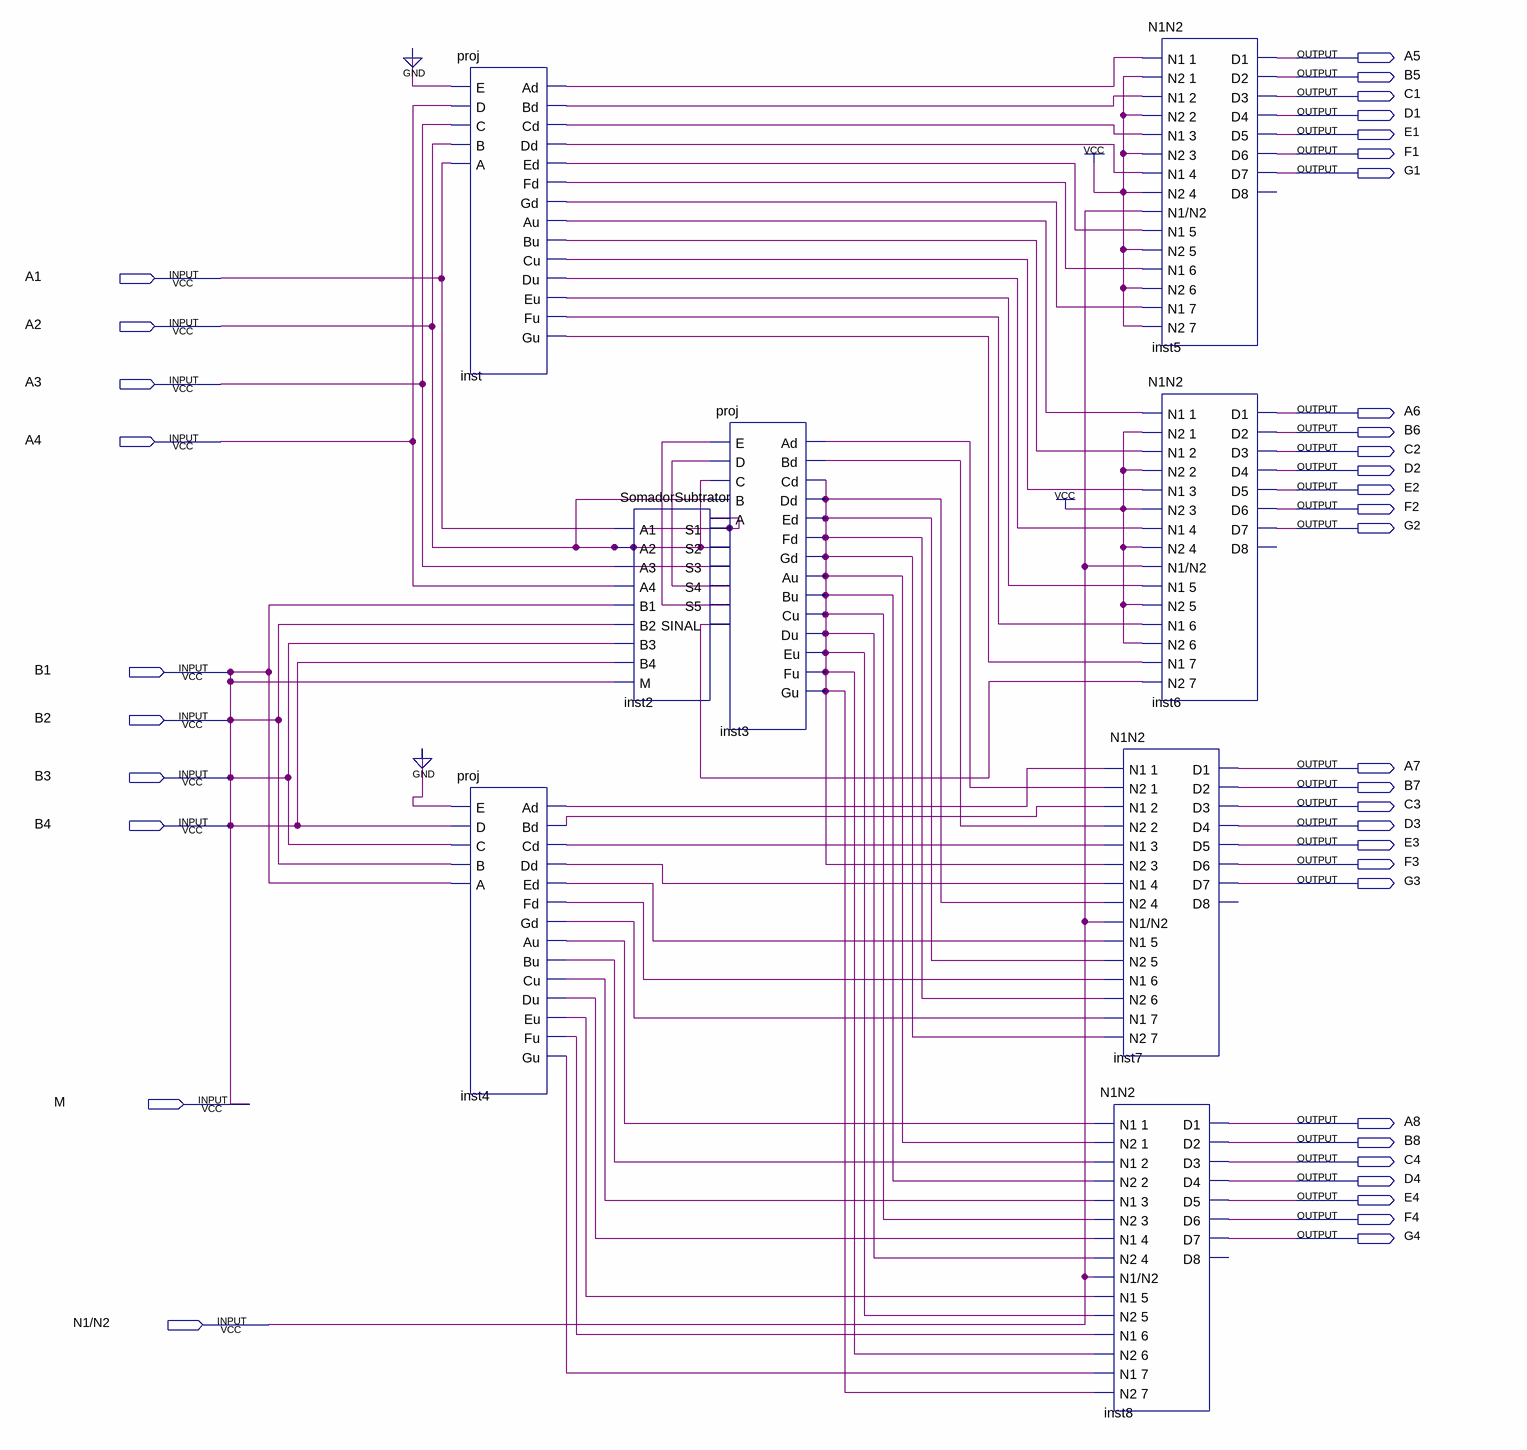
[diagram p0: schematic sheet]
// Quartus schematic Projeto-4JoaoPedroLopes.bdf as structural Verilog: 8 symbols, 38 pins
module \Projeto-4JoaoPedroLopes  (
  input  A1,
  input  A2,
  input  A3,
  input  A4,
  input  B1,
  input  B2,
  input  B3,
  input  B4,
  input  M,
  input  \N1/N2 ,
  output A5,
  output B5,
  output C1,
  output D1,
  output E1,
  output F1,
  output G1,
  output A6,
  output B6,
  output C2,
  output D2,
  output E2,
  output F2,
  output G2,
  output A7,
  output B7,
  output C3,
  output D3,
  output E3,
  output F3,
  output G3,
  output A8,
  output B8,
  output C4,
  output D4,
  output E4,
  output F4,
  output G4
);

  wire inst2_s1, inst2_s4, inst2_s5, inst2_sinal, inst3_ad, inst3_bd, inst3_cd, inst4_ad, inst4_au, inst4_bd,
       inst4_bu, inst4_cd, inst4_cu, inst4_dd, inst4_du, inst4_ed, inst4_eu, inst4_fd, inst4_fu, inst4_gd,
       inst4_gu, inst_ad, inst_au, inst_bd, inst_bu, inst_cd, inst_cu, inst_dd, inst_du, inst_ed, inst_eu,
       inst_fd, inst_fu, inst_gd, inst_gu;

  proj inst (
    .E(1'b0), .D(A4), .C(A3), .B(A2), .A(A1), .Ad(inst_ad), .Bd(inst_bd), .Cd(inst_cd), .Dd(inst_dd),
    .Ed(inst_ed), .Fd(inst_fd), .Gd(inst_gd), .Au(inst_au), .Bu(inst_bu), .Cu(inst_cu), .Du(inst_du),
    .Eu(inst_eu), .Fu(inst_fu), .Gu(inst_gu));
  proj inst4 (
    .E(1'b0), .D(B1), .C(B1), .B(B1), .A(B1), .Ad(inst4_ad), .Bd(inst4_bd), .Cd(inst4_cd), .Dd(inst4_dd),
    .Ed(inst4_ed), .Fd(inst4_fd), .Gd(inst4_gd), .Au(inst4_au), .Bu(inst4_bu), .Cu(inst4_cu), .Du(inst4_du),
    .Eu(inst4_eu), .Fu(inst4_fu), .Gu(inst4_gu));
  SomadorSubtrator inst2 (
    .A1(A1), .A2(A2), .A3(A3), .A4(A4), .B1(B1), .B2(B1), .B3(B1), .B4(B1), .M(B1), .S1(inst2_s1), .S2(A2),
    .S3(A2), .S4(inst2_s4), .S5(inst2_s5), .SINAL(inst2_sinal));
  proj inst3 (
    .E(inst2_s5), .D(inst2_s4), .C(A2), .B(A2), .A(inst2_s1), .Ad(inst3_ad), .Bd(inst3_bd), .Cd(inst3_cd),
    .Dd(inst3_cd), .Ed(inst3_cd), .Fd(inst3_cd), .Gd(inst3_cd), .Au(inst3_cd), .Bu(inst3_cd), .Cu(inst3_cd),
    .Du(inst3_cd), .Eu(inst3_cd), .Fu(inst3_cd), .Gu(inst3_cd));
  N1N2 inst5 (
    .\N1_1 (inst_ad), .\N2_1 (1'b1), .\N1_2 (inst_bd), .\N2_2 (1'b1), .\N1_3 (inst_cd), .\N2_3 (1'b1),
    .\N1_4 (inst_dd), .\N2_4 (1'b1), .\N1/N2 (\N1/N2 ), .\N1_5 (inst_ed), .\N2_5 (1'b1), .\N1_6 (inst_fd),
    .\N2_6 (1'b1), .\N1_7 (inst_gd), .\N2_7 (1'b1), .D1(A5), .D2(B5), .D3(C1), .D4(D1), .D5(E1), .D6(F1),
    .D7(G1));  // open: D8
  N1N2 inst6 (
    .\N1_1 (inst_au), .\N2_1 (1'b1), .\N1_2 (inst_bu), .\N2_2 (1'b1), .\N1_3 (inst_cu), .\N2_3 (1'b1),
    .\N1_4 (inst_du), .\N2_4 (1'b1), .\N1/N2 (\N1/N2 ), .\N1_5 (inst_eu), .\N2_5 (1'b1), .\N1_6 (inst_fu),
    .\N2_6 (1'b1), .\N1_7 (inst_gu), .\N2_7 (inst2_sinal), .D1(A6), .D2(B6), .D3(C2), .D4(D2), .D5(E2),
    .D6(F2), .D7(G2));  // open: D8
  N1N2 inst7 (
    .\N1_1 (inst4_ad), .\N2_1 (inst3_ad), .\N1_2 (inst4_bd), .\N2_2 (inst3_bd), .\N1_3 (inst4_cd),
    .\N2_3 (inst3_cd), .\N1_4 (inst4_dd), .\N2_4 (inst3_cd), .\N1/N2 (\N1/N2 ), .\N1_5 (inst4_ed),
    .\N2_5 (inst3_cd), .\N1_6 (inst4_fd), .\N2_6 (inst3_cd), .\N1_7 (inst4_gd), .\N2_7 (inst3_cd), .D1(A7),
    .D2(B7), .D3(C3), .D4(D3), .D5(E3), .D6(F3), .D7(G3));  // open: D8
  N1N2 inst8 (
    .\N1_1 (inst4_au), .\N2_1 (inst3_cd), .\N1_2 (inst4_bu), .\N2_2 (inst3_cd), .\N1_3 (inst4_cu),
    .\N2_3 (inst3_cd), .\N1_4 (inst4_du), .\N2_4 (inst3_cd), .\N1/N2 (\N1/N2 ), .\N1_5 (inst4_eu),
    .\N2_5 (inst3_cd), .\N1_6 (inst4_fu), .\N2_6 (inst3_cd), .\N1_7 (inst4_gu), .\N2_7 (inst3_cd), .D1(A8),
    .D2(B8), .D3(C4), .D4(D4), .D5(E4), .D6(F4), .D7(G4));  // open: D8

  assign B2 = B1;
  assign B3 = B1;
  assign B4 = B1;
  assign M = B1;
endmodule
